# Altium schematic sheet TP7660H.schdoc
size 55 x 37 mm
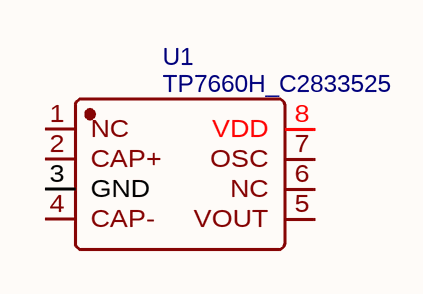
[diagram p0: TP7660H.schdoc]

## Parts
U1  TP7660H_C2833525  [SOIC-8_L4.9-W3.9-P1.27-LS6.0-BL]

## Nets

Not connected (* = marked no-connect by the designer): U1 1(NC) 2(CAP+) 3(GND) 4(CAP-) 5(VOUT) 6(NC) 7(OSC) 8(VDD)

## Library data of the parts
U1 = TP7660H_C2833525: BOM_Manufacturer: TOPPOWER(南京拓微); Contributor: LCSC; BOM_Supplier: LCSC; BOM_Supplier Part: C2833525; BOM_Manufacturer Part: TP7660H; BOM_JLCPCB Part Class: Extended Part; spicePre: U; spiceSymbolName: TP7660H_C2833525